# Altium schematic sheet PCIe.SchDoc
size A3; SheetNumber: 2; SheetTotal: 13
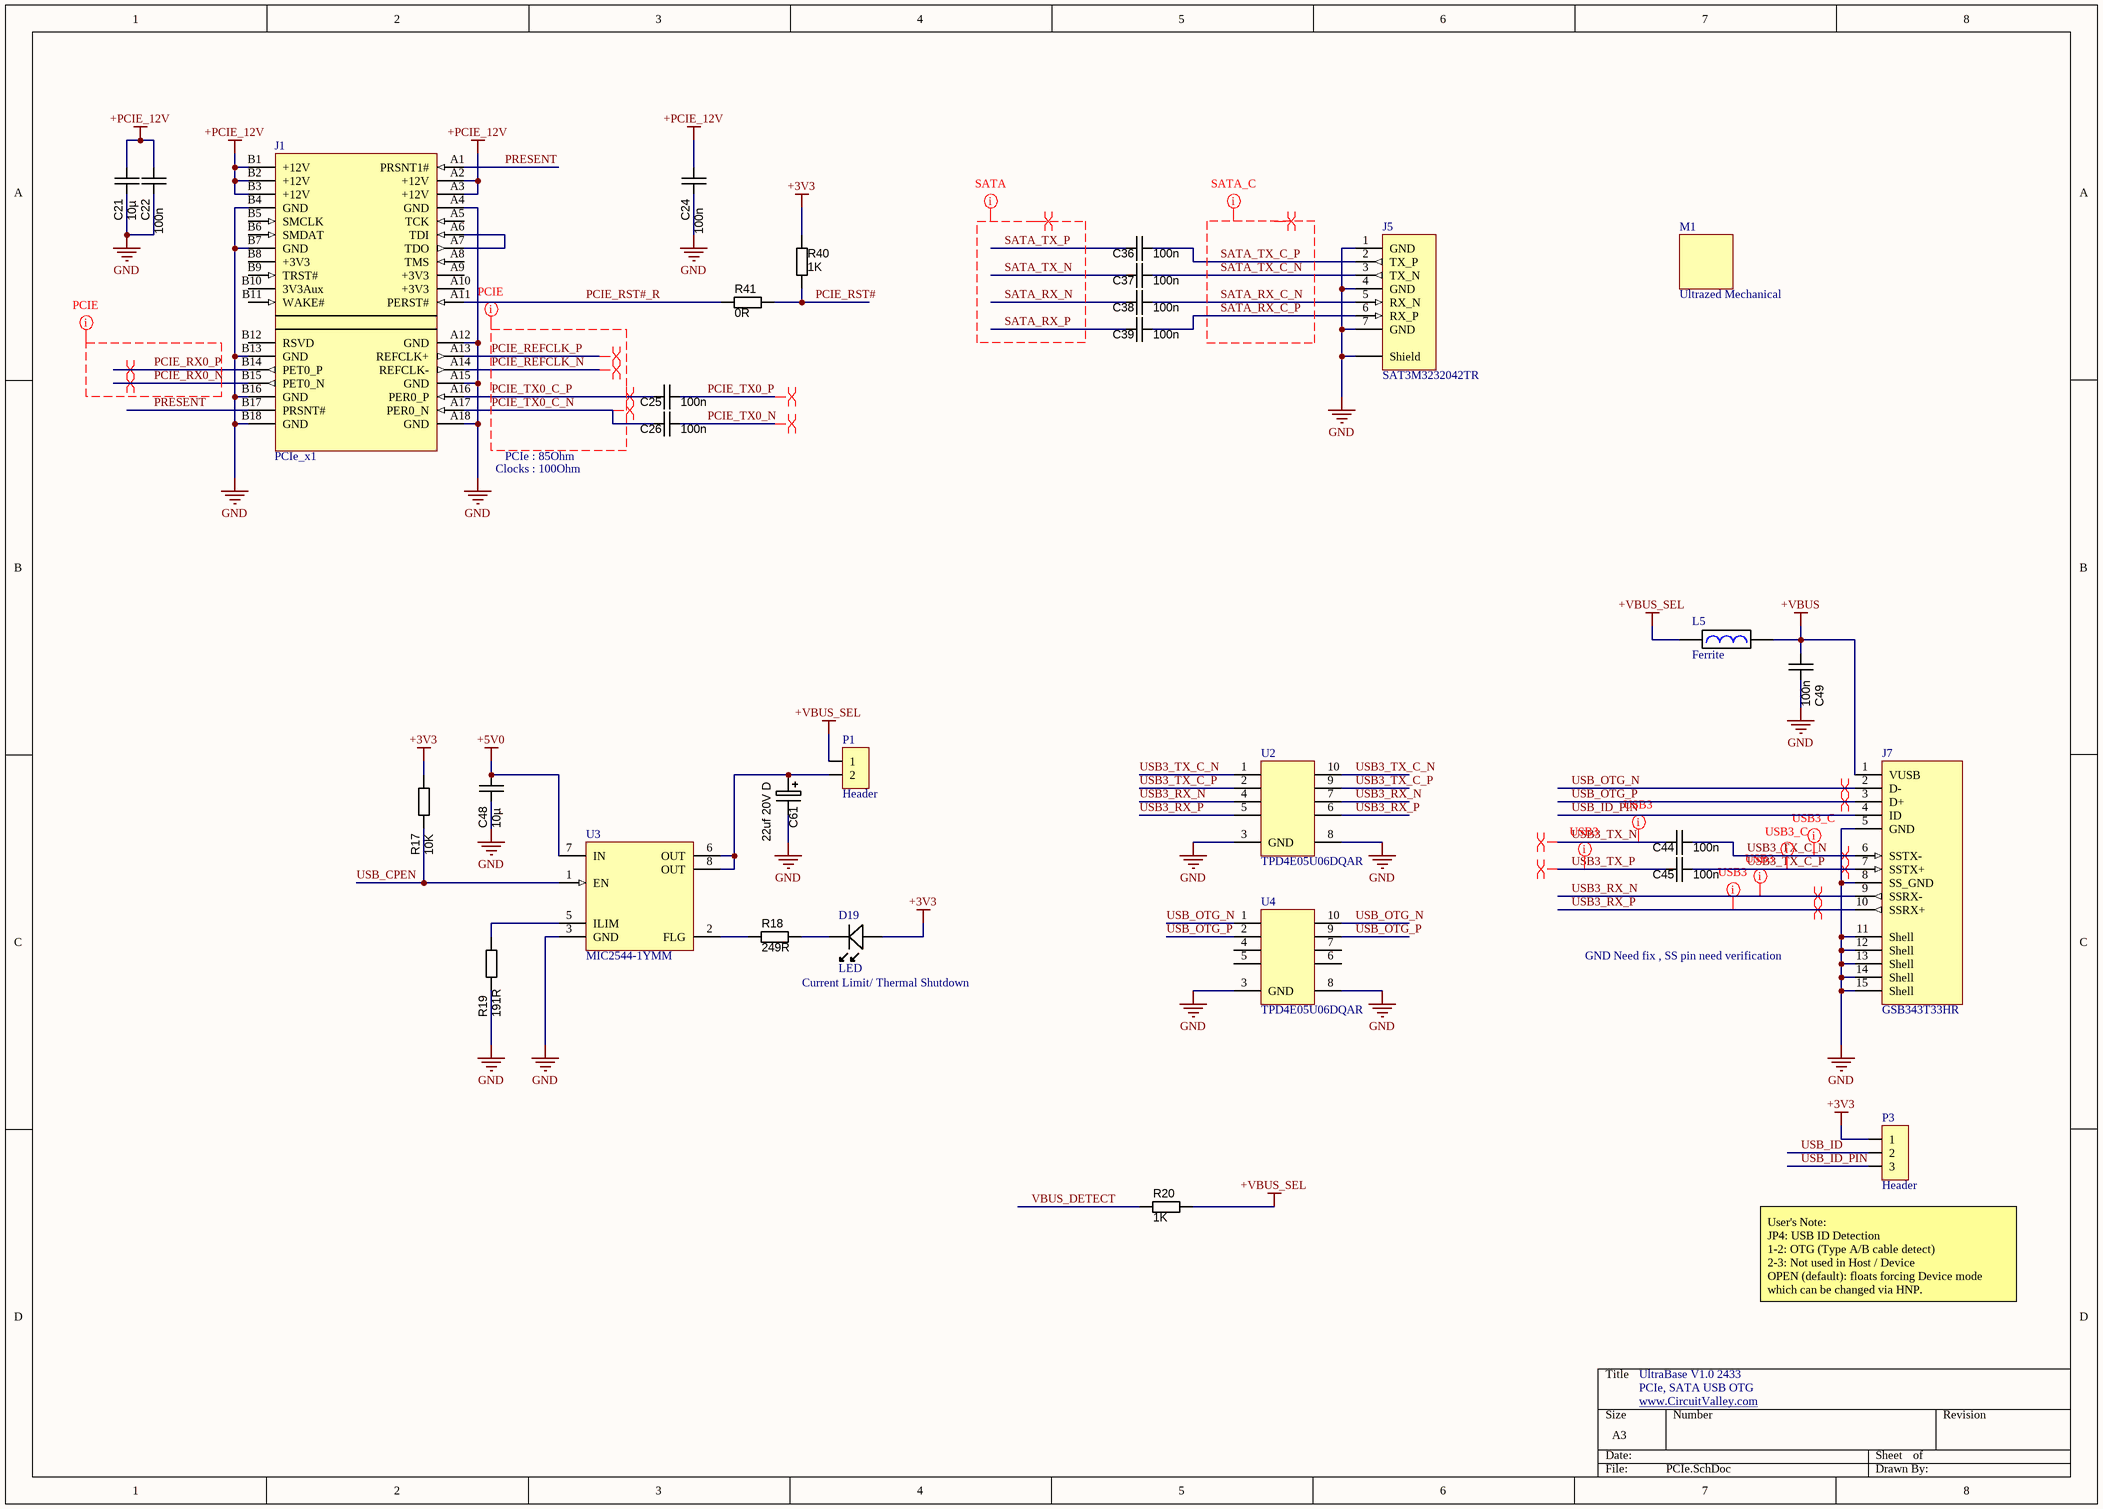
[diagram p0: PCIe.SchDoc]

## Parts
C21  10µ  [CAPC3225N]
C22  100n  [CAPC1608N]
C24  100n  [CAPC1608N]
C25  100n  [CAPC1005N]
C26  100n  [CAPC1005N]
C36  100n  [CAPC1005N]
C37  100n  [CAPC1005N]
C38  100n  [CAPC1005N]
C39  100n  [CAPC1005N]
C44  100n  [CAPC1005N]
C45  100n  [CAPC1005N]
C48  10µ  [CAPC3225N]
C49  100n  [CAPC1608N]
C61  value 22uf 20V D  [CAPMP7343X310N]  (hidden comment: 47uf 20V D)
D19  LED  [1206_LED]
J1  PCIe_x1  [PCIe_x1]
J5  SAT3M3232042TR  [SAT3M3232042TR]
J7  GSB343T33HR  [GSB343T33HR]
L5  Ferrite  [FBC2012N]
M1  Ultrazed Mechanical  [ULTRAZED_SOM_Mechanical]
P1  Header  [Header2x]
P3  Header  [Header3x]
R17  value 10K  [RESC1608N]  (hidden comment: RES_NL_0603)
R18  value 249R  [RESC1608N]  (hidden comment: RES_NL_0603)
R19  value 191R  [RESC1608N]  (hidden comment: RES_NL_0603)
R20  value 1K  [RESC1608N]  (hidden comment: RES_NL_0603)
R40  value 1K  [RESC1608N]  (hidden comment: RES_NL_0603)
R41  value 0R  [RESC1608N]  (hidden comment: RES_NL_0603)
U2  TPD4E05U06DQAR  [uDFN-10]
U3  MIC2544-1YMM  [MSOP8]
U4  TPD4E05U06DQAR  [uDFN-10]

## Nets
+3V3: D19.A P3.1 R17.1 R40.2
+5V0: C48.1 U3.7(IN)
+PCIE_12V: C21.1 C22.1 C24.1 J1.A2(+12V) J1.A3(+12V) J1.B1(+12V) J1.B2(+12V) J1.B3(+12V)
+VBUS: C49.1 J7.1(VUSB) L5.2
+VBUS_SEL: L5.1 P1.1 R20.2
GND: C21.2 C22.2 C24.2 C48.2 C49.2 C61.2 J1.A4(GND) J1.A12(GND) J1.A15(GND) J1.A18(GND) J1.B4(GND) J1.B7(GND) J1.B13(GND) J1.B16(GND) J1.B18(GND) J5.1(GND) J5.4(GND) J5.7(GND) J5.SH(Shield) J7.5(GND) J7.8(SS_GND) J7.11(Shell) J7.12(Shell) J7.13(Shell) J7.14(Shell) J7.15(Shell) R19.2 U2.3(GND) U2.8(GND) U3.3(GND) U4.3(GND) U4.8(GND)
PCIE_REFCLK_N: J1.A14(REFCLK-)
PCIE_REFCLK_P: J1.A13(REFCLK+)
PCIE_RST#: R40.1 R41.2
PCIE_RST#_R: J1.A11(PERST#) R41.1
PCIE_RX0_N: J1.B15(PET0_N)
PCIE_RX0_P: J1.B14(PET0_P)
PCIE_TX0_C_N: C26.1 J1.A17(PER0_N)
PCIE_TX0_C_P: C25.1 J1.A16(PER0_P)
PCIE_TX0_N: C26.2
PCIE_TX0_P: C25.2
PRESENT: J1.A1(PRSNT1#) J1.B17(PRSNT#)
SATA_RX_C_N: C38.2 J5.5(RX_N)
SATA_RX_C_P: C39.2 J5.6(RX_P)
SATA_RX_N: C38.1
SATA_RX_P: C39.1
SATA_TX_C_N: C37.2 J5.3(TX_N)
SATA_TX_C_P: C36.2 J5.2(TX_P)
SATA_TX_N: C37.1
SATA_TX_P: C36.1
USB3_RX_N: J7.9(SSRX-) U2.4 U2.7
USB3_RX_P: J7.10(SSRX+) U2.5 U2.6
USB3_TX_C_N: C44.2 J7.6(SSTX-) U2.1 U2.10
USB3_TX_C_P: C45.2 J7.7(SSTX+) U2.2 U2.9
USB3_TX_N: C44.1
USB3_TX_P: C45.1
USB_CPEN: R17.2 U3.1(EN)
USB_ID: P3.2
USB_ID_PIN: J7.4(ID) P3.3
USB_OTG_N: J7.2(D-) U4.1 U4.10
USB_OTG_P: J7.3(D+) U4.2 U4.9
VBUS_DETECT: R20.1
NetC61_1: C61.1 P1.2 U3.6(OUT) U3.8(OUT)
NetD19_K: D19.K R18.2
NetJ1_A6: J1.A6(TDI) J1.A7(TDO)
NetR18_1: R18.1 U3.2(FLG)
NetR19_1: R19.1 U3.5(ILIM)

Not connected (* = marked no-connect by the designer): J1 A5(TCK) A8(TMS) A9(+3V3) A10(+3V3) B5(SMCLK) B6(SMDAT) B8(+3V3) B9(TRST#) B10(3V3Aux) B11(WAKE#) B12(RSVD); U4 4 5 6 7

## Layout directives
differential pair: PCIE_REFCLK_N, PCIE_REFCLK_P, PCIE_RX0_N, PCIE_RX0_P, PCIE_TX0_C_N, PCIE_TX0_C_P, PCIE_TX0_N, PCIE_TX0_P, SATA_RX_C_N, SATA_RX_C_P, SATA_RX_N, SATA_RX_P, SATA_TX_C_N, SATA_TX_C_P, SATA_TX_N, SATA_TX_P, USB3_RX_N, USB3_RX_P, USB3_TX_C_N, USB3_TX_C_P, USB3_TX_N, USB3_TX_P, USB_OTG_N, USB_OTG_P
net class SATA: SATA_RX_N, SATA_RX_P, SATA_TX_N, SATA_TX_P
net class SATA_C: SATA_RX_C_N, SATA_RX_C_P, SATA_TX_C_N, SATA_TX_C_P
net class PCIE: PCIE_REFCLK_N, PCIE_REFCLK_P, PCIE_RX0_N, PCIE_RX0_P, PCIE_TX0_C_N, PCIE_TX0_C_P
net class USB3: USB3_RX_N, USB3_RX_P, USB3_TX_N, USB3_TX_P
net class USB3_C: USB3_TX_C_N, USB3_TX_C_P

## Notes on the sheet
- Clocks : 100Ohm
- PCIe : 85Ohm
- Current Limit/ Thermal Shutdown
- GND Need fix , SS pin need verification
- (near P3) User's Note:
  JP4: USB ID Detection
  1-2: OTG (Type A/B cable detect)
  2-3: Not used in Host / Device
  OPEN (default): floats forcing Device mode
  which can be changed via HNP.
- UltraBase V1.0 2433
- PCIe, SATA USB OTG
- www.CircuitValley.com <http://www.CircuitValley.com>

## Library data of the parts
C21 C48 = CAPC_10u_1210_50V: Capacitor SMD Cer 10uF 20% 16V X5R 1210; Manufacturer 1: Taiyo Yuden; Manufacturer Part Number 1: UMK325BJ106MM-T; Ratings: 50V; X5R; Material: ceramic; Package / Case: 1210 (3225 Metric); Tolerance: ±20%; Size / Dimension: 0.126" L x 0.098" W (3.20mm x 2.50mm); Supplier 1: Digi-Key; Supplier Part Number 1: 587-2225-1-ND; Value: 10µ
C22 C24 C49 = CAPC_120p_0603_C0G_50V: Capacitor SMD Cer 120pF 10% 50V C0G 0603; Manufacturer 1: Kemet; Manufacturer Part Number 1: C0603C121K5GACTU; Ratings: 50V; C0G; Tolerance: ±10%; Operating Temperature: -55°C ~ 125°C; Package / Case: 0603 (1608 Metric); Supplier 1: Mouser; Supplier Part Number 1: 80-C0603C121K5G; Value: 100n
C25 C26 C36-C39 C44 C45 = CAPC_100n_0402_16V_10%: Capacitor SMD Cer 100nF 10% 16V X5R 0402; Manufacturer 1: AVX Corporation; Manufacturer Part Number 1: 0402YD104KAT2A; Ratings: 16V; X7R; Tolerance: ±10%; Operating Temperature: -55°C ~ 125°C; Package / Case: 0402 (1005 Metric); Size / Dimension: 0.039" L x 0.020" W (1.00mm x 0.50mm); Supplier 1: Digi-Key; Supplier Part Number 1: 478-1126-1-ND; ComponentLink1URL: http://www.avx.com/docs/Catalogs/cx5r.pdf; ComponentLink1Description: http://www.avx.com/docs/Catalogs/cx5r.pdf; Supplier 2: Digi-Key; Supplier Part Number 2: 311-1347-1-ND; Manufacturer 2: Yageo; Manufacturer Part Number 2: CC0402KRX5R7BB104; ComponentLink2URL: http://www.yageo.com/documents/recent/UPY-GPHC_X5R_4V-to-50V_12.pdf; ComponentLink2Description: http://www.yageo.com/documents/recent/UPY-GPHC_X5R_4V-to-50V_12.pdf; Value: 100n
C61 = CAPT_330u_2917_6V3: Capacitor SMD Tant 330uF 20% 6V3 2917; Manufacturer Part Number: T520D337M006ATE015; Part: TCJY226M025R0070; Ratings: 6.3V; Material: Solid Tantalum; ESR (Equivalent Series Resistance): 15 mOhm; Package / Case: 2917 (7343 Metric); Tolerance: ±20%; Operating Temperature: -55°C ~ 125°C; Size / Dimension: 0.287" L x 0.169" W (7.30mm x 4.30mm); Height - Seated (Max): 0.122" (3.10mm); Manufacturer Size Code: D; Supplier 1: Digi-Key; Supplier Part Number 1: 399-4052-1-ND; ComponentLink1URL: http://www.kemet.com/datasheets&T520D337M006ATE015; ComponentLink1Description: T520D Datasheet
J1 = PCIe_x1: PCIe X1 Card edge
J5 = SAT3M3232042TR: Sata Connector Vertical
J7 = GSB343T33HR: USB3.2 Micro B
L5 = Ferrite Bead
M1 = UltrazedSOMMechanical
P1 = Header_2Pin: 2 Pin Header
P3 = Header_3Pin: 3 Pin Header
R17-R20 R40 R41 = RES_NL_0603: Resistor, SMD chip; Manufacturer 1: Royal Ohm; Ratings: 1/10 W; Tolerance: ±5%; Package / Case: 0603 (1608 metric)
U2 U4 = TPD4E05U06DQAR: ESD Protection
U3 = MIC2544: High Side Switch, Current limit programmable